# Altium schematic sheet NEB_XTALOSC.SchDoc
size A4; Organization: Altium Limited; Address1: L3, 12a Rodborough Rd; Address2: Frenchs Forest; Address3: NSW; Address4: Australia 2086; DocumentNumber: 2; SheetNumber: 2; SheetTotal: 10
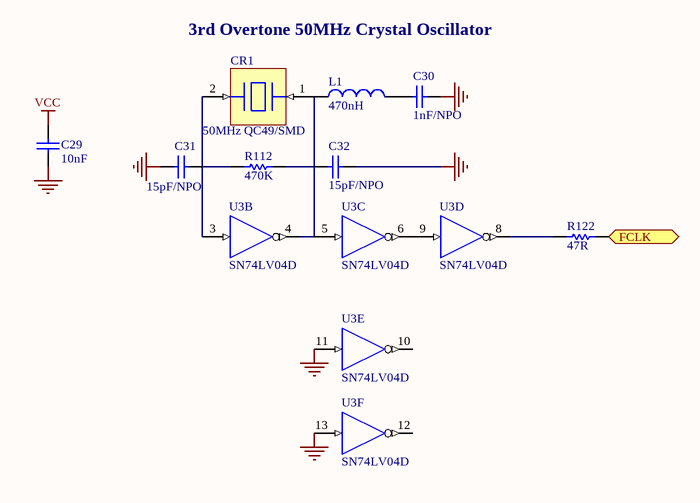
[diagram p0: NEB_XTALOSC.SchDoc]

## Parts
C29  10nF  [CC2012-0805]
C30  1nF/NPO  [CC2012-0805]
C31  15pF/NPO  [CC2012-0805]
C32  15pF/NPO  [CC2012-0805]
CR1  50MHz QC49/SMD  [QC49/SMD]
L1  470nH  [CR2012-0805]
R112  470K  [CR2012-0805]
R122  47R  [CR2012-0805]
U3  SN74LV04D  [D014]  (parts B,C,D,E,F of 6)

## Ports
FCLK (out)

## Nets
GND: C29.1 C30.1 C31.2 C32.1 U3.7(GND) U3.11(A) U3.13(A)
VCC: C29.2 U3.14(VCC)
FCLK: R122.1 ; port FCLK
NetC30_2: C30.2 L1.2
NetC31_1: C31.1 CR1.2 R112.2 U3.3(A)
NetC32_2: C32.2 CR1.1 L1.1 R112.1 U3.4(Y) U3.5(A)
NetR122_2: R122.2 U3.8(Y)
NetU3_6: U3.6(Y) U3.9(A)

Not connected (* = marked no-connect by the designer): U3 10(Y) 12(Y)

## Notes on the sheet
- 3rd Overtone 50MHz Crystal Oscillator
- Title
- Size:
- Date:
- A4
- Number:
- Time:
- Revision:
- Sheet
- of
- File:

## Library data of the parts
C29-C32 = CAP: Capacitor; Supplier: FARNELL
  C29: Supplier Code: 335-2020
  C30: Supplier Code: 718-567
  C31 C32: Supplier Code: 476-5930
CR1 = QC49/SMD: SMD Crystal 50MHz HY-Q; Fitted: True; C-MAC Watch Crystal: *; Farnel/RS-316-0312: *; 4.13$: *; C-MAC/FOX: *; Future: *
L1 = Inductor: Value: BLM18AG102SN1; Published: 8-Jun-2000; Revision: July-2002: Re-released for DXP Platform.; Publisher: Altium Limited; Supplier: FARNELL; Supplier Code: 383-7970
R112 R122 = RES: Resistor; Fitted: True
U3 = SN74LV04D: Hex Inverter; Package Information: Latest Revision: Jan-1998; Published: 8-Jun-2000; Revision: 17-Jul-2002: Re-released for DXP Platform.; Datasheet: Latest Revision: Apr-1996; Package Reference: D014; Publisher: Altium Limited